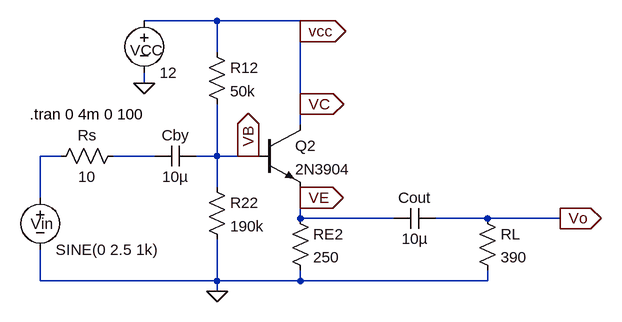
[diagram p0: schematic casc_cc.asc]
casc_cc.asc, the LTspice schematic file:
Version 4
SHEET 1 880 680
WIRE 256 -96 144 -96
WIRE 384 -96 256 -96
WIRE 384 -80 384 -96
WIRE 256 -48 256 -96
WIRE 144 0 144 -16
WIRE 384 32 384 -80
WIRE 384 64 384 32
WIRE 16 112 -16 112
WIRE 160 112 96 112
WIRE 256 112 256 32
WIRE 256 112 224 112
WIRE 304 112 256 112
WIRE 320 112 304 112
WIRE 256 160 256 112
WIRE -16 176 -16 112
WIRE 384 176 384 160
WIRE 384 208 384 176
WIRE 528 208 384 208
WIRE 672 208 592 208
WIRE 784 208 672 208
WIRE -16 304 -16 256
WIRE 256 304 256 240
WIRE 256 304 -16 304
WIRE 384 304 384 288
WIRE 384 304 256 304
WIRE 672 304 672 288
WIRE 672 304 384 304
WIRE 256 320 256 304
FLAG 144 0 0
FLAG 256 320 0
FLAG 304 112 VB
IOPIN 304 112 Out
FLAG 384 176 VE
IOPIN 384 176 Out
FLAG 384 32 VC
IOPIN 384 32 Out
FLAG 384 -80 vcc
IOPIN 384 -80 Out
FLAG 784 208 Vo
IOPIN 784 208 Out
SYMBOL res 240 -64 R0
SYMATTR InstName R12
SYMATTR Value 50k
SYMBOL res 240 144 R0
SYMATTR InstName R22
SYMATTR Value 190k
SYMBOL npn 320 64 R0
SYMATTR InstName Q2
SYMATTR Value 2N3904
SYMBOL res 368 192 R0
SYMATTR InstName RE2
SYMATTR Value 250
SYMBOL cap 224 96 R90
WINDOW 0 0 32 VBottom 2
WINDOW 3 32 32 VTop 2
SYMATTR InstName Cby
SYMATTR Value 10µ
SYMBOL voltage 144 -112 R0
WINDOW 0 -22 61 Left 2
SYMATTR InstName VCC
SYMATTR Value 12
SYMBOL cap 592 192 R90
WINDOW 0 0 32 VBottom 2
WINDOW 3 32 32 VTop 2
SYMATTR InstName Cout
SYMATTR Value 10µ
SYMBOL res 656 192 R0
SYMATTR InstName RL
SYMATTR Value 390
SYMBOL voltage -16 160 R0
WINDOW 0 -15 56 Left 2
WINDOW 123 0 0 Left 0
WINDOW 39 0 0 Left 0
SYMATTR InstName Vin
SYMATTR Value SINE(0 2.5 1k)
SYMBOL res 112 96 R90
WINDOW 0 0 56 VBottom 2
WINDOW 3 32 56 VTop 2
SYMATTR InstName Rs
SYMATTR Value 10
TEXT -32 48 Left 2 !.tran 0 4m 0 100

The netlist it stands for:
* casc_cc.asc
R12 vcc VB 50k
R22 VB 0 190k
Q2 vcc VB VE 0 2N3904
RE2 VE 0 250
Cby VB N002 10µ
VCC vcc 0 12
Cout Vo VE 10µ
RL Vo 0 390
Vin N001 0 SINE(0 2.5 1k)
Rs N002 N001 10
.model NPN NPN
.model PNP PNP
.lib standard.bjt
.tran 0 4m 0 100
.backanno
.end